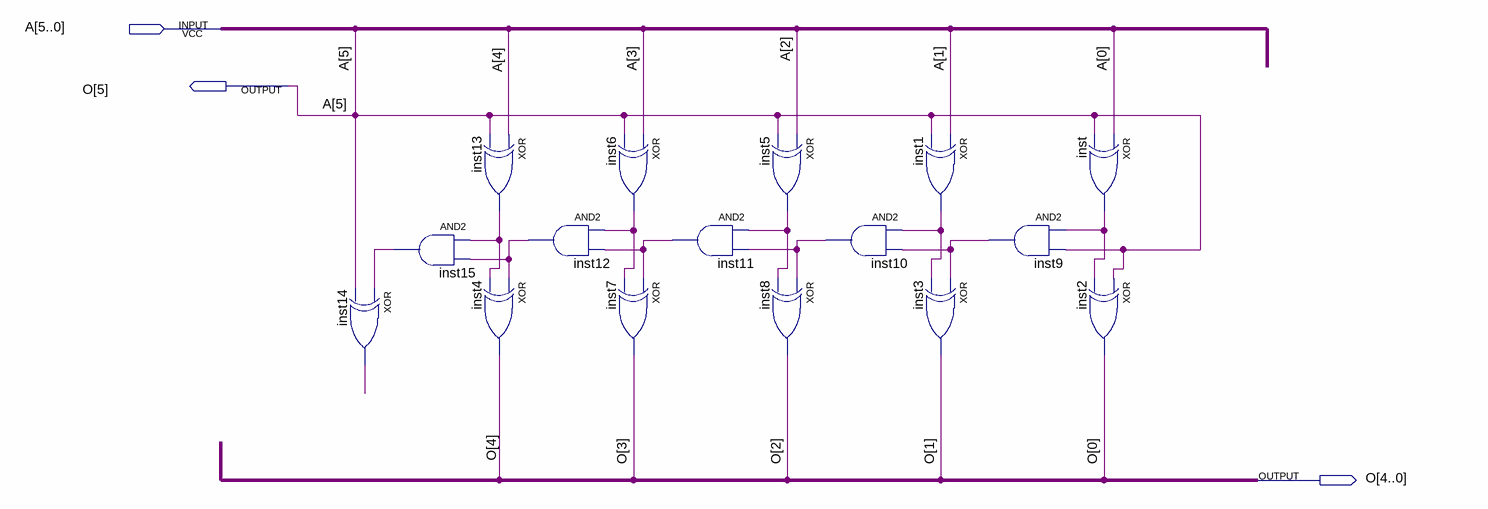
[diagram p0: schematic sheet]
// Quartus schematic C2_5.bdf as structural Verilog: 16 symbols, 3 pins
module C2_5 (
  input  [5:0] A,
  output [5:0] O
);

  wire inst1_out, inst5_out, inst6_out, inst9_out, inst10_out, inst11_out, inst12_out, inst13_out,
       inst14_out, inst15_out, inst_out;

  xor inst14 (inst14_out, inst15_out, A[5]);
  and inst15 (inst15_out, inst13_out, inst12_out);
  xor inst13 (inst13_out, A[4], A[5]);
  xor inst4 (O[4], inst12_out, inst13_out);
  and inst12 (inst12_out, inst6_out, inst11_out);
  xor inst6 (inst6_out, A[3], A[5]);
  xor inst7 (O[3], inst11_out, inst6_out);
  and inst11 (inst11_out, inst5_out, inst10_out);
  xor inst5 (inst5_out, A[2], A[5]);
  xor inst8 (O[2], inst10_out, inst5_out);
  and inst10 (inst10_out, inst1_out, inst9_out);
  xor inst1 (inst1_out, A[1], A[5]);
  xor inst3 (O[1], inst9_out, inst1_out);
  and inst9 (inst9_out, inst_out, A[5]);
  xor inst (inst_out, A[0], A[5]);
  xor inst2 (O[0], A[5], inst_out);

  assign O[5] = A[5];
endmodule
